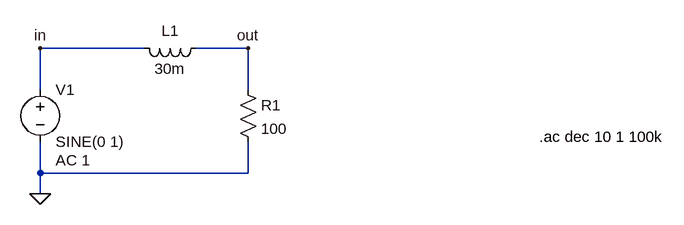
[diagram p0: schematic lr_circuit.asc]
lr_circuit.asc, the LTspice schematic file:
Version 4
SHEET 1 912 680
WIRE -48 112 -208 112
WIRE 112 112 32 112
WIRE -208 176 -208 112
WIRE 112 176 112 112
WIRE -208 304 -208 256
WIRE 112 304 112 256
WIRE 112 304 -208 304
WIRE -208 336 -208 304
FLAG -208 336 0
FLAG 112 112 out
FLAG -208 112 in
SYMBOL res 96 160 R0
SYMATTR InstName R1
SYMATTR Value 100
SYMBOL voltage -208 160 R0
WINDOW 123 24 124 Left 2
WINDOW 39 0 0 Left 0
SYMATTR Value2 AC 1
SYMATTR InstName V1
SYMATTR Value SINE(0 1)
SYMBOL ind 48 96 R90
WINDOW 0 5 56 VBottom 2
WINDOW 3 32 56 VTop 2
SYMATTR InstName L1
SYMATTR Value 30m
TEXT 560 248 Left 2 !.ac dec 10 1 100k

The netlist it stands for:
* lr_circuit.asc
R1 out 0 100
V1 in 0 SINE(0 1) AC 1
L1 out in 30m
.ac dec 10 1 100k
.backanno
.end